# Altium schematic sheet Sheet8.SchDoc
size B
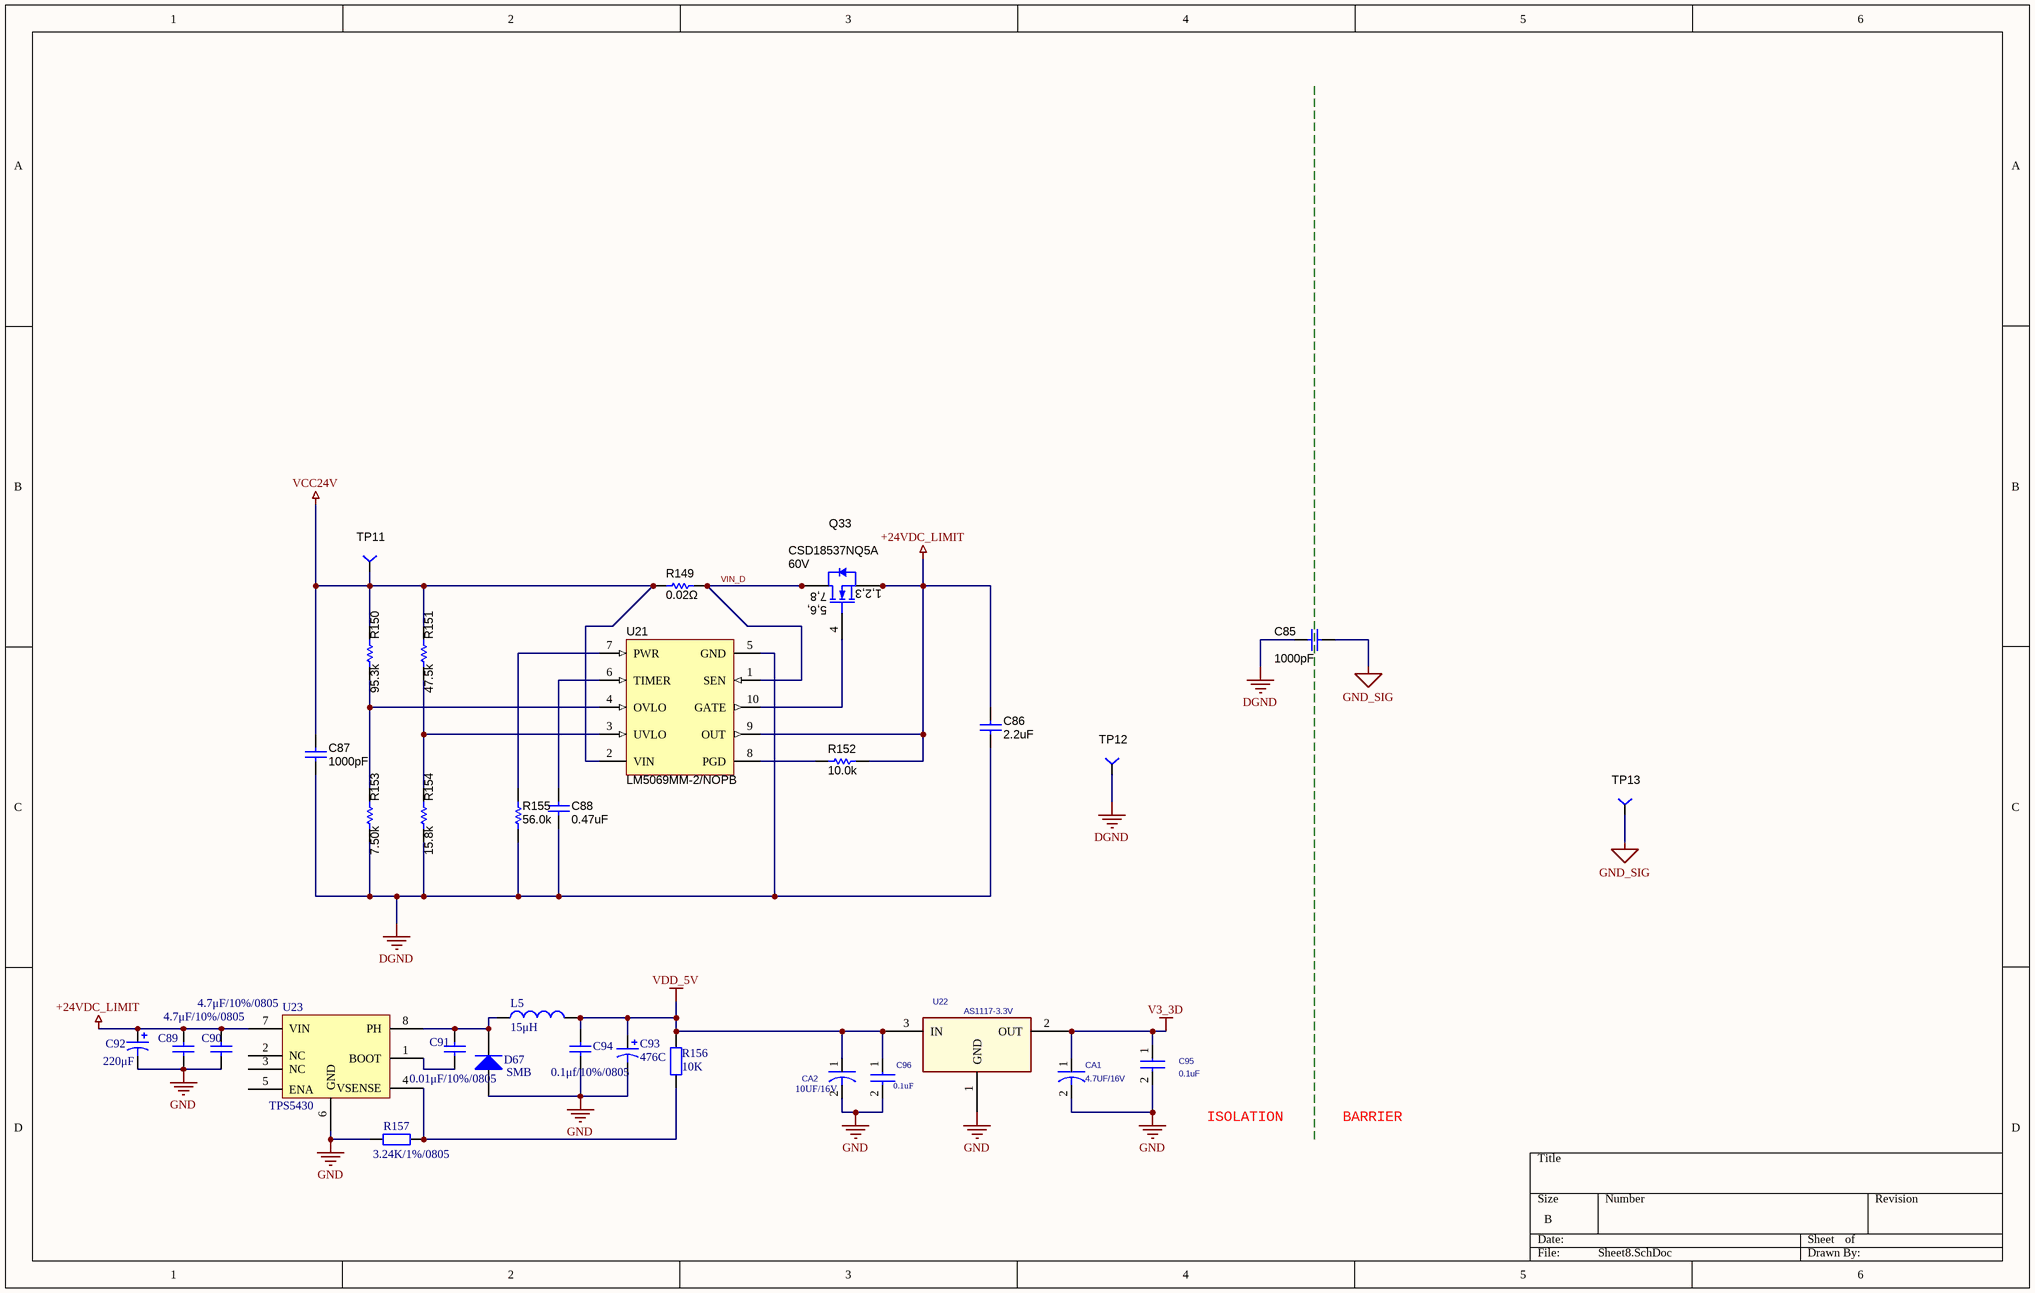
[diagram p0: Sheet8.SchDoc]

## Parts
C85  value 1000pF  [1206]  (hidden comment: 202R18W102KV4E)
C86  ValueDisplayed: 2.2uF  [1210]  (hidden comment: GRM32ER72A225KA35L)
C87  ValueDisplayed: 1000pF  [0805_cap]  (hidden comment: 06031C102JAT2A)
C88  ValueDisplayed: 0.47uF  [0805_cap]  (hidden comment: UMK107ABJ474KA-T)
C89  4.7μF/10%/0805  [0805_CAP]
C90  4.7μF/10%/0805  [0805_CAP]
C91  0.01μF/10%/0805  [0805_CAP]
C92  220μF  [CZ3.0/6.5]
C93  476C  [7343-43]
C94  0.1μf/10%/0805  [0805_CAP]
C95  0.1uF  [0805_CAP]
C96  0.1uF  [0805_CAP]
CA1  4.7UF/16V  [3528cap]
CA2  10UF/16V  [3528cap]
D67  SMB  [SMB]
L5  15μH  [GSDS104C2]
Q33  CSD18537NQ5A  value 60V  [TRANS_NexFET_Q5A]
R149  value 0.02Ω  [1206]  (hidden comment: PRL1632-R020-F-T1)
R150  value 95.3k  [0805]  (hidden comment: CRCW060395K3FKEA)
R151  value 47.5k  [0805]  (hidden comment: CRCW060347K5FKEA)
R152  value 10.0k  [0805]  (hidden comment: CRCW060310K0FKEA)
R153  value 7.50k  [0805]  (hidden comment: CRCW06037K50FKEA)
R154  value 15.8k  [0805]  (hidden comment: CRCW060315K8FKEA)
R155  value 56.0k  [0805]  (hidden comment: RG1608P-563-B-T5)
R156  10K  [0805]
R157  3.24K/1%/0805  [0805]
TP11  TP-040_RND  [TP-040_RND]  (value not drawn)
TP12  TP-040_RND  [TP-040_RND]  (value not drawn)
TP13  TP-040_RND  [TP-040_RND]  (value not drawn)
U21  LM5069MM-2/NOPB  [MUB10A_N]
U22  AS1117-3.3V  [SOT-223]
U23  TPS5430  [SO-G8]

## Nets
+24VDC_LIMIT: C86.1 C89.2 C90.2 C92.1 Q33.1(S) Q33.2(S) Q33.3(S) R152.1 U21.9(OUT) U23.7(VIN)
DGND: C85.1 C86.2 C87.2 C88.2 R153.1 R154.1 R155.1 TP12.1 U21.5(GND)
GND: C89.1 C90.1 C92.2 C93.2 C94.1 C95.2 C96.2 CA1.2 CA2.2 D67.1(A) R157.2 U22.1(GND) U23.6(GND)
GND_SIG: C85.2 TP13.1
V3_3D: C95.1 CA1.1 U22.2(OUT)
VCC24V: C87.1 R149.1 R150.2 R151.2 TP11.1 U21.2(VIN)
VDD_5V: C93.1 C94.2 C96.1 CA2.1 L5.2 R156.2 U22.3(IN)
VIN_D: Q33.5(D) Q33.6(D) Q33.7(D) Q33.8(D) Q33.9(D) R149.2 U21.1(SEN)
NetC88_1: C88.1 U21.6(TIMER)
NetC91_1: C91.1 U23.1(BOOT)
NetC91_2: C91.2 D67.2(K) L5.1 U23.8(PH)
NetQ33_4: Q33.4(G) U21.10(GATE)
NetR150_1: R150.1 R153.2 U21.4(OVLO)
NetR151_1: R151.1 R154.2 U21.3(UVLO)
NetR152_2: R152.2 U21.8(PGD)
NetR155_2: R155.2 U21.7(PWR)
NetR156_1: R156.1 R157.1 U23.4(VSENSE)

Not connected (* = marked no-connect by the designer): U23 2(NC) 3(NC) 5(ENA)

## Notes on the sheet
- ISOLATION       BARRIER
- (in symbol CSD18537NQ5A) 7,8; 1,2,3; 5,6,

## Library data of the parts
C85 = 202R18W102KV4E: CAP, CERM, 1000pF, 2KV 10% X7R 1206; Manufacturer: Johanson Dielectrics Inc; Polarized: N; CompType: Capacitor; Cap_F: 0.000000001; Tolerance_%: 0; PartNumber: 202R18W102KV4E; PackageReference: 1206; RoHS: Y; Value2: 2KV; MountType: SMT; Technology: Ceramic; Cap_Case: 1206; Publisher: Texas Instruments; ComponentLink1Description: Datasheet link; ComponentLink1URL: http://www.johansondielectrics.com/images/stories/catalog/JDI-Product-Catalog.pdf; Supplier 1: Digi-Key; Supplier Part Number 1: 709-1036-1-ND; ValueDisplayed: 1000pF
C86 = GRM32ER72A225KA35L: CAP, CERM, 2.2uF, 100V, +/-10%, X7R, 1210; Manufacturer: MuRata; Polarized: N; CompType: Capacitor; U/M: EA; Cap_F: 0.0000022; Tolerance_%: 10; ESR_Ohm: 0.007; Value1: 0.007 ohm; VDC_V: 100; IRMS_A: 4.4; TaMin_C: -55; TaMax_C: 125; SymbolVersion: 2008-07-09; Value: 2.2uF; PartNumber: GRM32ER72A225KA35L; PackageReference: 1210; RoHS: Y; Value2: 100V; MountType: SMT; Technology: Ceramic; TempCo: X7R; Cap_Case: 1210; Published: 2008-06-19; Publisher: Texas Instruments; LatestRevisionDate: 2013-11-21; ComponentLink1Description: Datasheet link; ComponentLink1URL: http://search.murata.co.jp/Ceramy/PnsearchViewAction.do?HnOFG=ON&HnNFG=ON&SEL_CNT=50&sLang=en&sKey=GRM32ER72A225KA35L&x=9&y=9&search=startwith; Supplier 1: Digi-Key; Supplier Part Number 1: 490-3385-1-ND; Supplier 2: Mouser; Supplier Part Number 2: 81-GRM32ER72A225KA35; Supplier 3: Farnell; Supplier Part Number 3: 1735547
C87 = 06031C102JAT2A: CAP, CERM, 1000pF, 100V, +/-5%, X7R, 0603; Manufacturer: AVX; Polarized: N; CompType: Capacitor; U/M: EA; Cap_F: 0.000000001; Tolerance_%: 5; ESR_Ohm: 0.276; Value1: 0.276 ohm; VDC_V: 100; TaMin_C: -55; TaMax_C: 125; Cap_Case: 0603; SymbolVersion: 2008-07-09; Value: 1000pF; PartNumber: 06031C102JAT2A; PackageReference: 0603; RoHS: Y; Value2: 100V; MountType: SMT; Technology: Ceramic; TempCo: X7R; Published: 2008-06-19; Publisher: Texas Instruments; LatestRevisionDate: 2013-11-21; ComponentLink1Description: Datasheet link; ComponentLink1URL: http://www.avx.com/docs/masterpubs/smccp.pdf; Supplier 1: Digi-Key; Supplier Part Number 1: 478-3698-1-ND; Supplier 2: Mouser; Supplier Part Number 2: 581-06031C102J; Supplier 3: Farnell; Supplier Part Number 3: 1740627
C88 = UMK107ABJ474KA-T: CAP, CERM, 0.47uF, 50V, 10%, X5R, 0603; Manufacturer: Taiyo Yuden; Polarized: N; CompType: Capacitor; Cap_F: 0.00000047; Tolerance_%: 10; VDC_V: 50; Cap_Case: 0603; Value: 0.47uF; PartNumber: UMK107ABJ474KA-T; PackageReference: 0603; RoHS: Y; Value2: 50V; MountType: SMT; Technology: Ceramic; TempCo: X5R; Publisher: Texas Instruments; ComponentLink1Description: Datasheet link; ComponentLink1URL: http://www.yuden.co.jp/productdata/catalog/en/mlcc101_e.pdf; Supplier 1: Digi-Key; Supplier Part Number 1: 587-3171-6-ND
C89-C91 C94 = Cap: Capacitor; Value: 0.01uF; Published: 8-Jun-2000; LatestRevisionDate: 17-Jul-2002; LatestRevisionNote: Re-released for DXP Platform.; PackageReference: RAD-0.3; Publisher: Altium Limited; PackageDescription: Radial Cap, Thru-Hole; 2 Leads; 0.3 in Pin Spacing
C92 = Cap Pol1: Polarized Capacitor (Radial); Value: 1uF; Published: 8-Jun-2000; LatestRevisionDate: 17-Jul-2002; LatestRevisionNote: Re-released for DXP Platform.; PackageReference: RB7.6-15; Publisher: Altium Limited; PackageDescription: Polarized Capacitor (Radial); 2 Leads
C93 = Cap Pol1: Polarized Capacitor (Radial); Value: 2.2uF; Published: 8-Jun-2000; LatestRevisionDate: 17-Jul-2002; LatestRevisionNote: Re-released for DXP Platform.; PackageReference: RB7.6-15; Publisher: Altium Limited; PackageDescription: Polarized Capacitor (Radial); 2 Leads
C95 C96 = C
CA1 CA2 = ECAP
D67 = Diode 1N5408: 3 Amp Medium Power Silicon Rectifier Diode; Published: 8-Jun-2000; LatestRevisionDate: 17-Jul-2002; LatestRevisionNote: Re-released for DXP Platform.; DatasheetVersion: Aug-1984; PackageReference: DO-201AD; Publisher: Altium Limited; PackageDescription: Diode, Axial; Body 9.5 x 5.3 mm (LxDia. max), Lead Dia. 1.32 mm (max); ComponentLink1Description: Manufacturer Link; ComponentLink1URL: http://www.irf.com/
L5 = Inductor: Code_IEC: 1005; Value: 10mH; Published: 8-Jun-2000; LatestRevisionDate: 29-May-2009; LatestRevisionNote: IPC-7351 Footprint Added.; PackageReference: 0402-A; Publisher: Altium Limited; PackageDescription: Chip Inductor; Code_JEITA: 0402
Q33 = CSD18537NQ5A: MOSFET, N-CH, 60V, 50A, SON 5x6mm; Manufacturer: Texas Instruments; Alternate Manufacturer: None; U/M: EA; ChType: N; VdsMax_V: 60; Value1: 0.036 ohm; Rdson45_Ohm: 0.036; Value2: 14 nC; QgTyp_nC: 14; Vgs_V: 20; IdsMax_A: 50; SymbolVersion: 2011-08-16; PartNumber: CSD18537NQ5A; PackageReference: SON 5x6mm; CompType: MOSFET; RoHS: Y; MountType: SMT; Published: 2008-06-19; Publisher: Texas Instruments; LatestRevisionDate: 2013-11-21; LatestRevisionNote: Added parts.; ComponentLink1Description: Datasheet link; ComponentLink1URL: http://www.ti.com/lit/ds/symlink/csd18537nq5a.pdf
R149 = PRL1632-R020-F-T1: RES, 0.02 ohm, 1%, 1W, 1206; Manufacturer: Susumu Co Ltd; CompType: Resistor; Res_ohm: 0.02; Value_Code: R020; Tolerance_%: 1; TempCo: 100 ppm/C; EIA_Code: E96; U/M: EA; SymbolVersion: 2009-05-29; PartNumber: PRL1632-R020-F-T1; PackageReference: 1206; RoHS: Y; Value1: 1%; Power_W: 1; Value2: 1W; MountType: SMT; Technology: Thin Film; Published: 2008-06-26; Publisher: Texas Instruments; LatestRevisionDate: 2013-10-09; ComponentLink1Description: Datasheet link; ComponentLink1URL: http://www.susumu.co.jp/english/pdf/products-j01-07.pdf; Supplier 1: Digi-Key; Supplier Part Number 1: PRL1632.020FCT-ND; Supplier 2: Mouser; Supplier Part Number 2: 754-PRL1632-R020-FT1; Supplier 3: Farnell; Supplier Part Number 3: 1268779
R150 = CRCW060395K3FKEA: RES, 95.3k ohm, 1%, 0.1W, 0603; Manufacturer: Vishay-Dale; CompType: Resistor; Res_ohm: 95300; Value_Code: 95k3; Tolerance_%: 1; Power_W: 0.1; VDC_V: 75; TempCo: 100 ppm/C; EIA_Code: E96; U/M: EA; SymbolVersion: 2009-05-29; PartNumber: CRCW060395K3FKEA; PackageReference: 0603; RoHS: Y; Value1: 1%; Value2: 0.1W; MountType: SMT; Technology: Thick Film; Published: 2008-06-26; Publisher: Texas Instruments; LatestRevisionDate: 2013-10-22; ComponentLink1Description: Datasheet link; ComponentLink1URL: http://www.vishay.com/docs/20035/dcrcwe3.pdf; Supplier 1: Digi-Key; Supplier Part Number 1: 541-95.3KHCT-ND; Supplier 2: Mouser; Supplier Part Number 2: 71-CRCW0603-95.3K-E3; Supplier 3: Farnell; Supplier Part Number 3: 1152173
R151 = CRCW060347K5FKEA: RES, 47.5k ohm, 1%, 0.1W, 0603; Manufacturer: Vishay-Dale; CompType: Resistor; Res_ohm: 47500; Value_Code: 47k5; Tolerance_%: 1; Power_W: 0.1; VDC_V: 75; TempCo: 100 ppm/C; EIA_Code: E96; U/M: EA; SymbolVersion: 2009-05-29; PartNumber: CRCW060347K5FKEA; PackageReference: 0603; RoHS: Y; Value1: 1%; Value2: 0.1W; MountType: SMT; Technology: Thick Film; Published: 2008-06-26; Publisher: Texas Instruments; LatestRevisionDate: 2013-10-22; ComponentLink1Description: Datasheet link; ComponentLink1URL: http://www.vishay.com/docs/20035/dcrcwe3.pdf; Supplier 1: Digi-Key; Supplier Part Number 1: 541-47.5KHCT-ND; Supplier 2: Mouser; Supplier Part Number 2: 71-CRCW0603-47.5K-E3; Supplier 3: Farnell; Supplier Part Number 3: 1469813
R152 = CRCW060310K0FKEA: RES, 10.0k ohm, 1%, 0.1W, 0603; Manufacturer: Vishay-Dale; CompType: Resistor; Res_ohm: 10000; Value_Code: 10k0; Tolerance_%: 1; Power_W: 0.1; VDC_V: 75; TempCo: 100 ppm/C; EIA_Code: E96; U/M: EA; SymbolVersion: 2009-05-29; PartNumber: CRCW060310K0FKEA; PackageReference: 0603; RoHS: Y; Value1: 1%; Value2: 0.1W; MountType: SMT; Technology: Thick Film; Published: 2008-06-26; Publisher: Texas Instruments; LatestRevisionDate: 2013-10-22; ComponentLink1Description: Datasheet link; ComponentLink1URL: http://www.vishay.com/docs/20035/dcrcwe3.pdf; Supplier 1: Digi-Key; Supplier Part Number 1: 541-10.0KHCT-ND; Supplier 2: Mouser; Supplier Part Number 2: 71-CRCW0603-10K-E3; Supplier 3: Farnell; Supplier Part Number 3: 1469748
R153 = CRCW06037K50FKEA: RES, 7.50k ohm, 1%, 0.1W, 0603; Manufacturer: Vishay-Dale; CompType: Resistor; Res_ohm: 7500; Value_Code: 7k50; Tolerance_%: 1; Power_W: 0.1; VDC_V: 75; TempCo: 100 ppm/C; EIA_Code: E96; U/M: EA; SymbolVersion: 2009-05-29; PartNumber: CRCW06037K50FKEA; PackageReference: 0603; RoHS: Y; Value1: 1%; Value2: 0.1W; MountType: SMT; Technology: Thick Film; Published: 2008-06-26; Publisher: Texas Instruments; LatestRevisionDate: 2013-10-22; ComponentLink1Description: Datasheet link; ComponentLink1URL: http://www.vishay.com/docs/20035/dcrcwe3.pdf; Supplier 1: Digi-Key; Supplier Part Number 1: 541-7.50KHCT-ND; Supplier 2: Mouser; Supplier Part Number 2: 71-CRCW0603-7.5K-E3; Supplier 3: Farnell; Supplier Part Number 3: 1469835
R154 = CRCW060315K8FKEA: RES, 15.8k ohm, 1%, 0.1W, 0603; Manufacturer: Vishay-Dale; CompType: Resistor; Res_ohm: 15800; Value_Code: 15k8; Tolerance_%: 1; Power_W: 0.1; VDC_V: 75; TempCo: 100 ppm/C; EIA_Code: E96; U/M: EA; SymbolVersion: 2009-05-29; PartNumber: CRCW060315K8FKEA; PackageReference: 0603; RoHS: Y; Value1: 1%; Value2: 0.1W; MountType: SMT; Technology: Thick Film; Published: 2008-06-26; Publisher: Texas Instruments; LatestRevisionDate: 2013-10-22; ComponentLink1Description: Datasheet link; ComponentLink1URL: http://www.vishay.com/docs/20035/dcrcwe3.pdf; Supplier 1: Digi-Key; Supplier Part Number 1: 541-15.8KHCT-ND; Supplier 2: Mouser; Supplier Part Number 2: 71-CRCW0603-15.8K-E3; Supplier 3: Farnell; Supplier Part Number 3: 1151707
R155 = RG1608P-563-B-T5: RES, 56.0k ohm, 0.1%, 0.1W, 0603; Manufacturer: Susumu Co Ltd; CompType: Resistor; Res_ohm: 56000; Value_Code: 56k0; Tolerance_%: 0.1; VDC_V: 75; TempCo: 25 ppm/C; U/M: EA; SymbolVersion: 2009-05-29; PartNumber: RG1608P-563-B-T5; PackageReference: 0603; RoHS: Y; Value1: 0.1%; Power_W: 0.1; Value2: 0.1W; MountType: SMT; Technology: Metal Film; Published: 2008-06-26; Publisher: Texas Instruments; LatestRevisionDate: 2013-10-22; ComponentLink1Description: Datasheet link; ComponentLink1URL: http://www.susumu.co.jp/english/pdf/products-j01-01.pdf; Supplier 1: Digi-Key; Supplier Part Number 1: RG16P56.0KBCT-ND; Supplier 2: Mouser; Supplier Part Number 2: 754-RG1608P-563-BT5
R156 = Res2: Resistor; Value: 100K; Published: 8-Jun-2000; LatestRevisionDate: 17-Jul-2002; LatestRevisionNote: Re-released for DXP Platform.; PackageReference: AXIAL-0.4; Publisher: Altium Limited; PackageDescription: Axial Device, Thru-Hole; 2 Leads; 0.4 in Pin Spacing
R157 = Res2: Resistor; Value: 1K; Published: 8-Jun-2000; LatestRevisionDate: 17-Jul-2002; LatestRevisionNote: Re-released for DXP Platform.; PackageReference: AXIAL-0.4; Publisher: Altium Limited; PackageDescription: Axial Device, Thru-Hole; 2 Leads; 0.4 in Pin Spacing
TP11-TP13 = TP-040_RND: Test Point, O.040 Hole; Manufacturer: Standard; Value: TP-040; area: *; SymbolVersion: 06/30/2008 16:03:57; PartNumber: Standard; ComponentLink1Description: AEO Datasheet Link
U21 = LM5069MM-2/NOPB: Positive High Voltage Hot Swap / Inrush Current Controller with Power Limiting, 10-pin MSOP, Pb-Free; Manufacturer: National Semiconductor; PackageTopMarking: ZXTT*SNBB; PowerWise: N; CompType: MiscPower; Published: 1-Mar-2010; DatasheetVersion: Mar-2008; PackageVersion: revB, Jul-2003; PackageReference: MUB10A; Publisher: Altium Limited; PackageDescription: Mini-SO, Molded, .118 x .118 x .034in Body, 10 Lead, .0197in Pitch; Supplier 1: Digi-Key; Supplier Part Number 1: LM5069MM-2TR-ND; Supplier 2: Digi-Key; Supplier Part Number 2: LM5069MM-2CT-ND; Supplier 3: Digi-Key; Supplier Part Number 3: LM5069MM-2DKR-ND; Supplier 4: Farnell; Supplier Part Number 4: 1654265; PartNumber: LM5069MM-2/NOPB; RoHS: Y; PinCount: 10; Code_JEDEC: MO-187-BA; ComponentLink1Description: LM5069 Datasheet; ComponentLink1URL: http://www.national.com/ds/LM/LM5069.pdf; ComponentLink2Description: LM5069 Web Page; ComponentLink2URL: http://www.national.com/pf/LM/LM5069.html; ComponentLink3Description: MUB10A Package Page; ComponentLink3URL: http://www.national.com/packaging/folders/mub10a.html
U22 = AS1117